# Altium project Rev1.PrjPcb
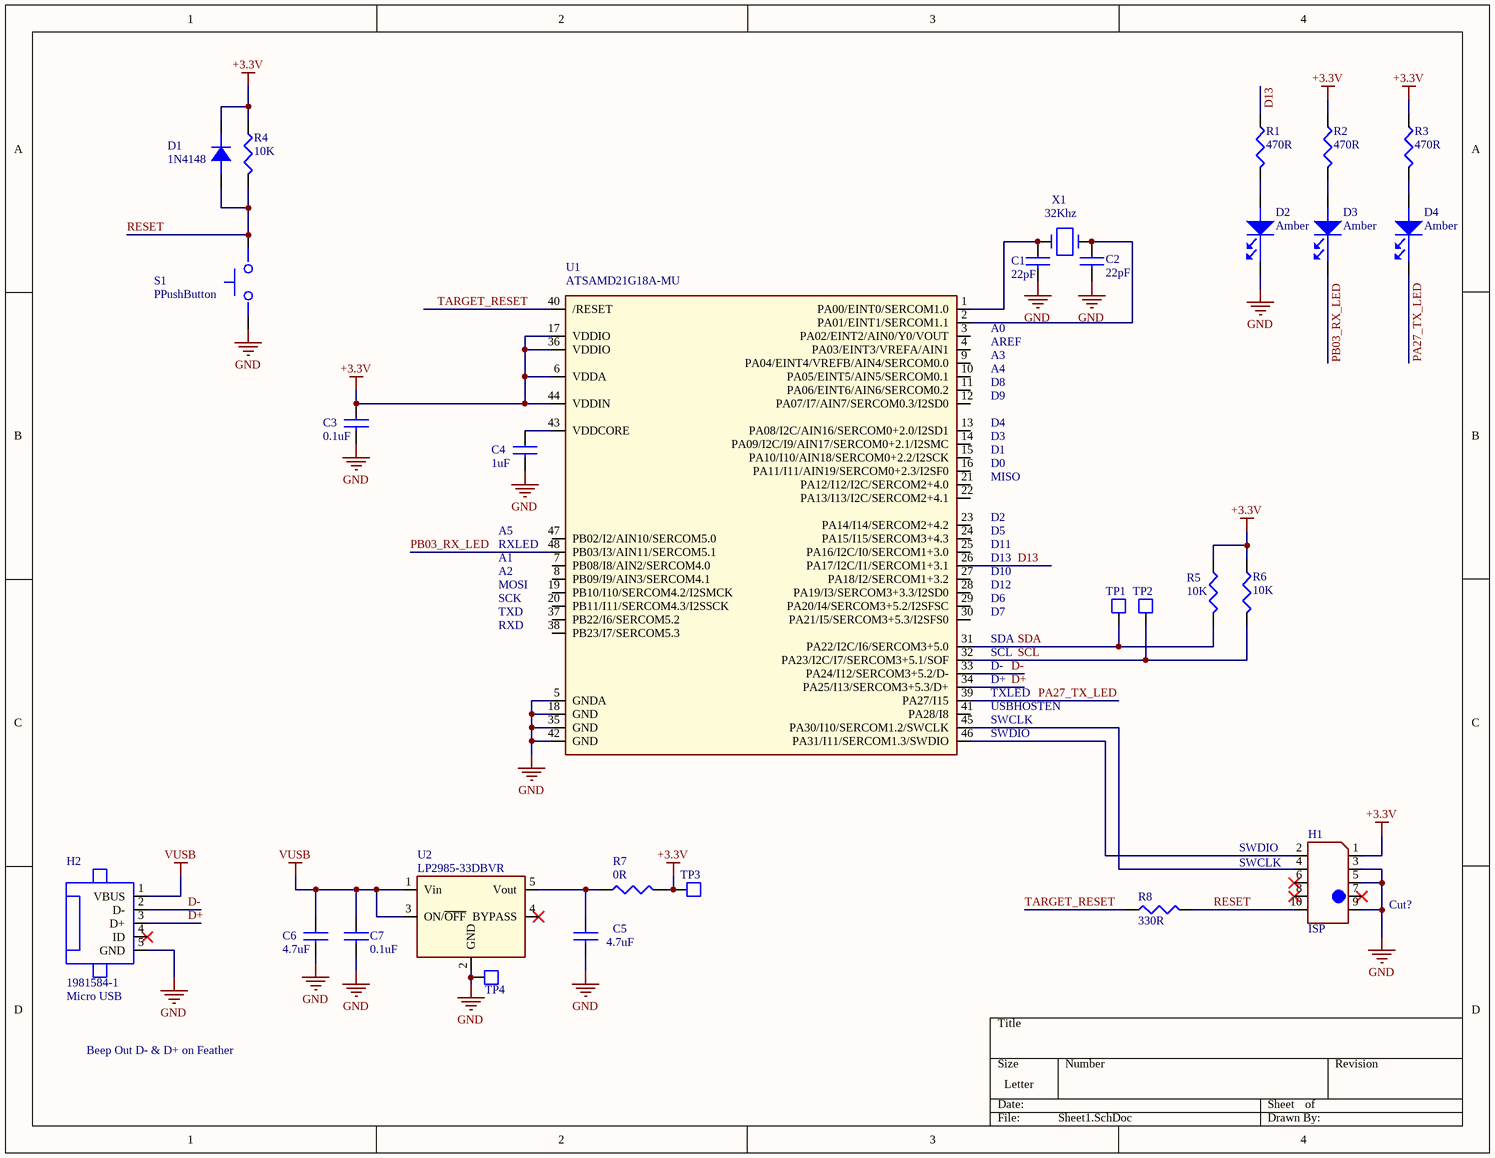
[diagram p0: Sheet1.SchDoc]
1 sheet, 29 parts. Net scope: global (net labels, ports and power ports of the same name join across sheets).
Board file: PCB_Rev1.PcbDoc

## Sheet Sheet1.SchDoc
size Letter

### Parts
C1  22pF  [CAPC1005X56N]
C2  22pF  [CAPC1005X56N]
C3  0.1uF  [CAPC1005X56N]
C4  1uF  [CAPC1005X56N]
C5  value 4.7uF  [CAPC3216X160L]  (hidden comment: CAP_1206)
C6  value 4.7uF  [CAPC3216X160L]  (hidden comment: CAP_1206)
C7  value 0.1uF  [CAPC1608X09L]
D1  1N4148  [SOD123]
D2  PartNumber: Amber  [LED1608X55N-YELLOW]  (hidden comment: LED_0603)
D3  PartNumber: Amber  [LED1608X55N-YELLOW]  (hidden comment: LED_0603)
D4  PartNumber: Amber  [LED1608X55N-YELLOW]  (hidden comment: LED_0603)
H1  ISP  [HDR5X2-50MIL]
H2  Micro USB  [1981584-1]
R1  470R  [RESC1005X40N]
R2  470R  [RESC1005X40N]
R3  470R  [RESC1005X40N]
R4  10K  [RESC1005X40N]
R5  10K  [RESC1005X40N]
R6  10K  [RESC1005X40N]
R7  0R  [RESC1005X40N]
R8  330R  [RESC1005X40N]
S1  PPushButton  [TL1015AF160QG]
TP1  Test Point, 1mm Top Layer  [TP100TL]  (value not drawn)  (no BOM)
TP2  Test Point, 1mm Top Layer  [TP100TL]  (value not drawn)  (no BOM)
TP3  Test Point, 1mm Top Layer  [TP100TL]  (value not drawn)  (no BOM)
TP4  Test Point, 1mm Top Layer  [TP100TL]  (value not drawn)  (no BOM)
U1  ATSAMD21G18A-MU  [LQFP48]
U2  LP2985-33DBVR  [SOT95P280X144-5N]
X1  value 32Khz  [ECS-.327-12.5-34B]  (hidden comment: ECS-.327-12.5-34B)

### Nets
+3.3V: C3.1 D1.1(Cathode) H1.1 R2.1 R3.1 R4.1 R5.1 R6.1 R7.2 TP3.1 U1.6(VDDA) U1.17(VDDIO) U1.36(VDDIO) U1.44(VDDIN)
GND: C1.2 C2.2 C3.2 C4.2 C5.2 C6.2 C7.2 D2.1(CATHODE) H1.3 H1.5 H1.9 H2.5(GND) S1.1(A) TP4.1 U1.5(GNDA) U1.18(GND) U1.35(GND) U1.42(GND) U2.2(GND)
VUSB: C6.1 C7.1 H2.1(VBUS) U2.1(Vin) U2.3(ON/~{OFF})
D13: R1.1 U1.26(PA17/I2C/I1/SERCOM1+3.1)
D+: H2.3(D+) U1.34(PA25/I13/SERCOM3+5.3/D+)
D-: H2.2(D-) U1.33(PA24/I12/SERCOM3+5.2/D-)
PA27_TX_LED: D4.1(CATHODE) U1.39(PA27/I15)
PB03_RX_LED: D3.1(CATHODE) U1.48(PB03/I3/AIN11/SERCOM5.1)
RESET: D1.2(Annode) H1.10 R4.2 R8.2 S1.2(B)
SCL: R6.2 TP2.1 U1.32(PA23/I2C/I7/SERCOM3+5.1/SOF)
SDA: R5.2 TP1.1 U1.31(PA22/I2C/I6/SERCOM3+5.0)
TARGET_RESET: R8.1 U1.40(/RESET)
NetC1_1: C1.1 U1.1(PA00/EINT0/SERCOM1.0) X1.1
NetC2_1: C2.1 U1.2(PA01/EINT1/SERCOM1.1) X1.2
NetC4_1: C4.1 U1.43(VDDCORE)
NetC5_1: C5.1 R7.1 U2.5(Vout)
NetD2_2: D2.2(ANODE) R1.2
NetD3_2: D3.2(ANODE) R2.2
NetD4_2: D4.2(ANODE) R3.2
NetH1_2: H1.2 U1.46(PA31/I11/SERCOM1.3/SWDIO)
NetH1_4: H1.4 U1.45(PA30/I10/SERCOM1.2/SWCLK)

Not connected (* = marked no-connect by the designer): H1 6* 7* 8*; H2 4(ID)*; U1 3(PA02/EINT2/AIN0/Y0/VOUT) 4(PA03/EINT3/VREFA/AIN1) 7(PB08/I8/AIN2/SERCOM4.0) 8(PB09/I9/AIN3/SERCOM4.1) 9(PA04/EINT4/VREFB/AIN4/SERCOM0.0) 10(PA05/EINT5/AIN5/SERCOM0.1) 11(PA06/EINT6/AIN6/SERCOM0.2) 12(PA07/I7/AIN7/SERCOM0.3/I2SD0) 13(PA08/I2C/AIN16/SERCOM0+2.0/I2SD1) 14(PA09/I2C/I9/AIN17/SERCOM0+2.1/I2SMC) 15(PA10/I10/AIN18/SERCOM0+2.2/I2SCK) 16(PA11/I11/AIN19/SERCOM0+2.3/I2SF0) 19(PB10/I10/SERCOM4.2/I2SMCK) 20(PB11/I11/SERCOM4.3/I2SSCK) 21(PA12/I12/I2C/SERCOM2+4.0) 22(PA13/I13/I2C/SERCOM2+4.1) 23(PA14/I14/SERCOM2+4.2) 24(PA15/I15/SERCOM3+4.3) 25(PA16/I2C/I0/SERCOM1+3.0) 27(PA18/I2/SERCOM1+3.2) 28(PA19/I3/SERCOM3+3.3/I2SD0) 29(PA20/I4/SERCOM3+5.2/I2SFSC) 30(PA21/I5/SERCOM3+5.3/I2SFS0) 37(PB22/I6/SERCOM5.2) 38(PB23/I7/SERCOM5.3) 41(PA28/I8) 47(PB02/I2/AIN10/SERCOM5.0); U2 4(BYPASS)*

### Notes on the sheet
- (near H1) SWCLK
- (near H1) SWDIO
- (near H1) Cut?
- Beep Out D- & D+ on Feather
- (in symbol ATSAMD21G18A-MU) A0; AREF; A3; A4; D8; D9; D4; D3; D1; D0; MISO; D2; A5; D5; RXLED; D11; A1; D13; A2; D10; MOSI; D12; SCK; D6; TXD; D7; RXD; SDA; SCL; D-; D+; TXLED; USBHOSTEN; SWCLK; SWDIO

### Library data of the parts
C1-C4 = CAP_0402: CAP 0402
  C1 C2: Value: 22pF
  C3: Value: 0.1uF
  C4: Value: 1uF
C5 C6 = CAP_1206: CAP CER 4.7uF, 1206
C7 = CAP_0603: CAP CER 0.1uF, 0603
D1 = 1N4148W-TP: DIODE SWITCH 100V 0.15A SOD123; Manufacturer: Micro Commercial; Vendor: Digikey; PartNumber: 1N4148W-TP; Value: 1N4148
H1 = CON5X2: JTAG CONN HEADER 5X2POS 50mil" PADS; PartNumber: PADS
H2 = 1981584-1: CONN RCPT MICRO USB TYPE AB; Manufacturer: TE Connectivity; Vendor: Digi-Key; PartNumber: 1981584-1; Value: Micro USB
R1-R8 = RES_0402: RES 0402
  R1-R3: Value: 470R
  R4-R6: Value: 10K
  R7: Value: 0R
  R8: Value: 330R
S1 = DX_MINI_TACT_SWITCH: DX_SWITCH TACTILE; PartNumber: 122514; Value: Mini PushButton
TP1 = Test Point, 1mm Top Layer: Value: SDA; PartNumber: N/A; Manufacturer: N/A
TP2-TP4 = Test Point, 1mm Top Layer: Value: SCL; PartNumber: N/A; Manufacturer: N/A
U1 = ATSAMD21G18A-MU: IC MCU 32BIT 256KB FLASH 48QFN; Manufacturer: Atmel; Vendor: Digi-Key; PartNumber: ATSAMD21G18A-MU
U2 = LP2985-33DBVR: IC REG LDO 3.3V .15A SOT23-5; Manufacturer: Texas Instruments; Vendor: Digikey; PartNumber: LP2985-33DBVR
X1 = ECS-.327-12.5-34B: CRYSTAL 32.768 KHZ 12.5PF SMD; Manufacturer: ECS; Vendor: Digi-Key; PartNumber: ECS-.327-12.5-34B